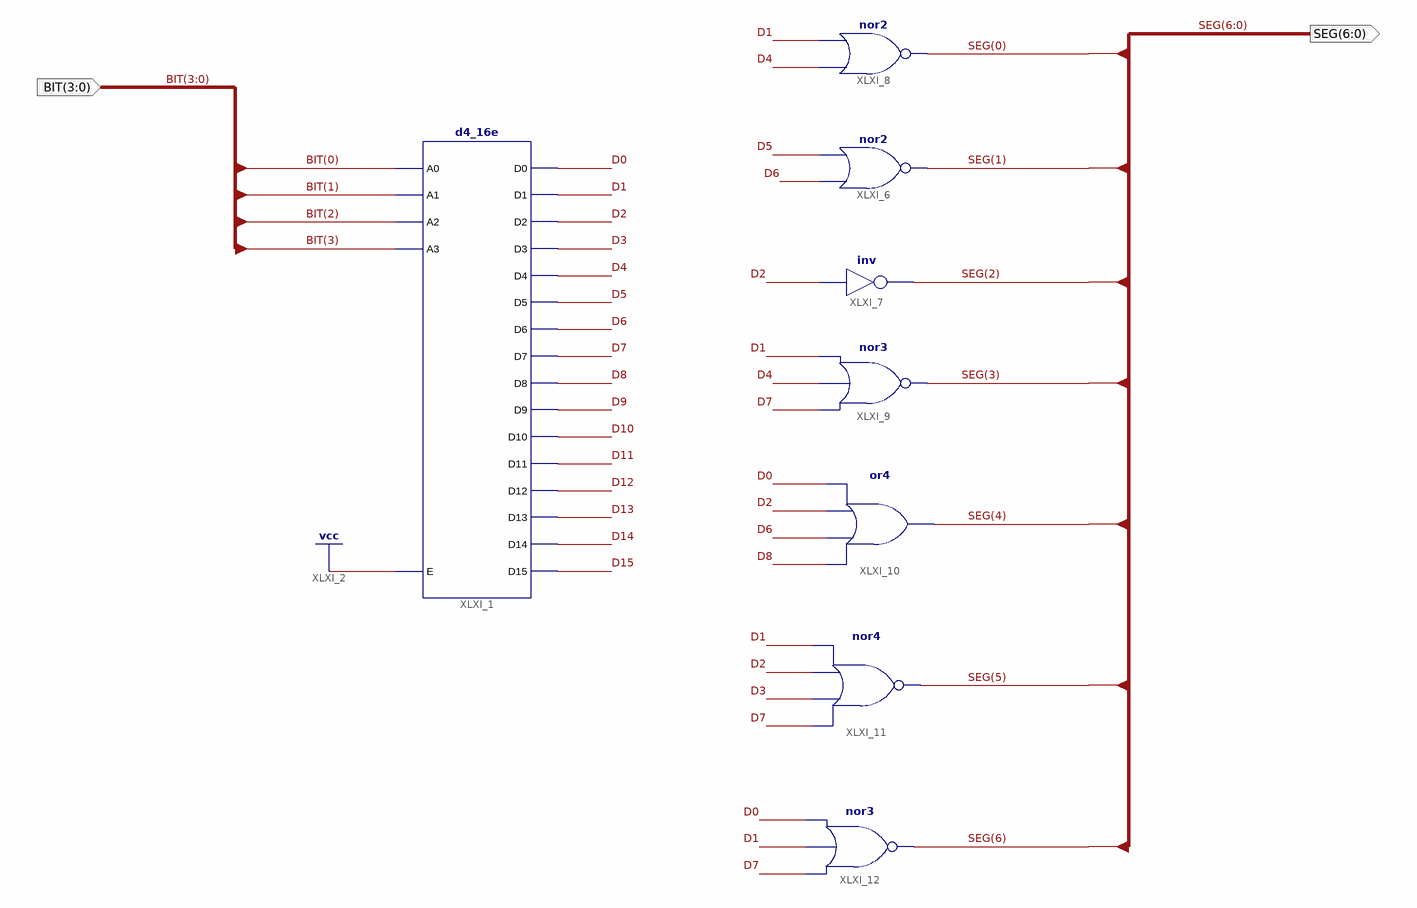
[diagram p0: schematic sheet 1]
// Xilinx ISE schematic BCD_TO_7SEG.sch (spartan6) as structural Verilog: 8 symbols, 2 ports
module BCD_TO_7SEG (
  input  [3:0] BIT,
  output [6:0] SEG
);

  wire D0, D1, D2, D3, D4, D5, D6, D7, D8, D9, D10, D11, D12, D13, D14, D15;

  d4_16e XLXI_1 (
    .A0(BIT[0]), .A1(BIT[1]), .A2(BIT[2]), .A3(BIT[3]), .E(1'b1), .D0(D0), .D1(D1), .D10(D10), .D11(D11),
    .D12(D12), .D13(D13), .D14(D14), .D15(D15), .D2(D2), .D3(D3), .D4(D4), .D5(D5), .D6(D6), .D7(D7),
    .D8(D8), .D9(D9));
  nor XLXI_6 (SEG[1], D6, D5);
  not XLXI_7 (SEG[2], D2);
  nor XLXI_8 (SEG[0], D4, D1);
  nor XLXI_9 (SEG[3], D7, D4, D1);
  or XLXI_10 (SEG[4], D8, D6, D2, D0);
  nor XLXI_11 (SEG[5], D7, D3, D2, D1);
  nor XLXI_12 (SEG[6], D7, D1, D0);
endmodule
